# EAGLE design CERVEAU_01b (EAGLE 8.5.1)
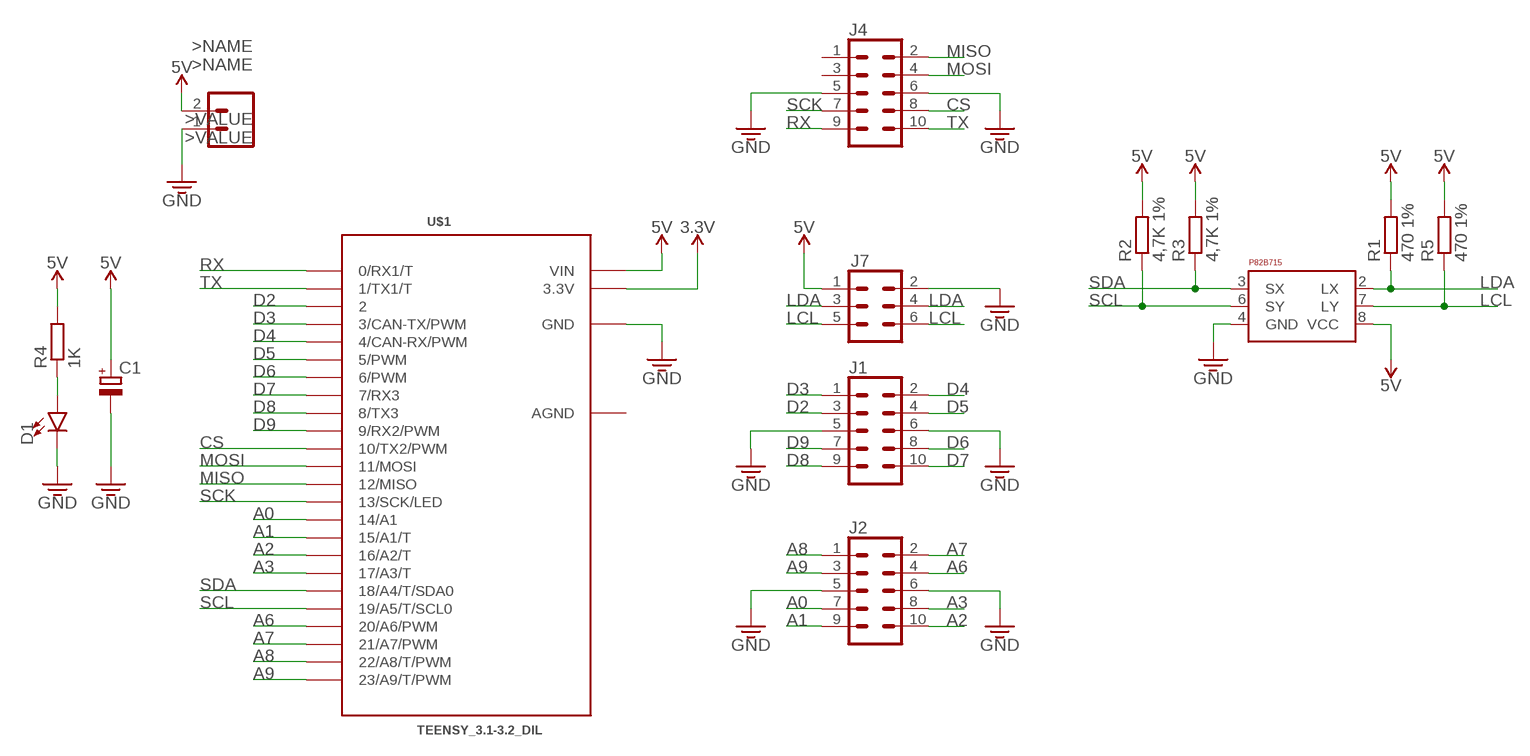
[diagram p0: schematic, sheet 1]

## Parts
C1  CPOL-EUE2.5-6  [E2,5-6]
D1  LED5MM  [LED_5MM]
J1  CONN_05X2SHD  [2X5-SHROUDED]
J2  CONN_05X2SHD  [2X5-SHROUDED]
J3  CONN_02POLAR  [MOLEX-1X2]
J4  CONN_05X2SHD  [2X5-SHROUDED]
J7  CONN_03X2SHROUD  [2X3-SHROUDED]
R1  470 1%  R-EU_0207/2V  [0207/2V]
R2  4,7K 1%  R-EU_0207/2V  [0207/2V]
R3  4,7K 1%  R-EU_0207/2V  [0207/2V]
R4  1K  R-EU_0207/2V  [0207/2V]
R5  470 1%  R-EU_0207/2V  [0207/2V]
U$1  TEENSY_3.1-3.2_DIL  [TEENSY_3.0-3.2&LC_DIL]
U$2  P82B715  [SOCKET-08]

## Nets
3.3V: U$1.3.3V
5V: C1.+ J3.2 J7.1 R1.2 R2.2 R3.2 R4.2 R5.2 U$1.VIN U$2.8(VCC)
A0: J2.7 U$1.14/A0(14/A1)
A1: J2.9 U$1.15/A1(15/A1/T)
A2: J2.10 U$1.16/A2(16/A2/T)
A3: J2.8 U$1.17/A3(17/A3/T)
A6: J2.4 U$1.20/A6(20/A6/PWM)
A7: J2.2 U$1.21/A7(21/A7/PWM)
A8: J2.1 U$1.22/A8(22/A8/T/PWM)
A9: J2.3 U$1.23/A9(23/A9/T/PWM)
CS: J4.8 U$1.10(10/TX2/PWM)
D2: J1.3 U$1.2
D3: J1.1 U$1.3(3/CAN-TX/PWM)
D4: J1.2 U$1.4(4/CAN-RX/PWM)
D5: J1.4 U$1.5(5/PWM)
D6: J1.8 U$1.6(6/PWM)
D7: J1.10 U$1.7(7/RX3)
D8: J1.9 U$1.8(8/TX3)
D9: J1.7 U$1.9(9/RX2/PWM)
GND: C1.- D1.K(C) J1.5 J1.6 J2.5 J2.6 J3.1 J4.5 J4.6 J7.2 U$1.GND U$2.4(GND)
LCL: J7.5 J7.6 R5.1 U$2.7(LY)
LDA: J7.3 J7.4 R1.1 U$2.2(LX)
MISO: J4.2 U$1.12(12/MISO)
MOSI: J4.4 U$1.11(11/MOSI)
N$1: D1.A R4.1
RX: J4.9 U$1.0(0/RX1/T)
SCK: J4.7 U$1.13(13/SCK/LED)
SCL: R2.1 U$1.19/A5(19/A5/T/SCL0) U$2.6(SY)
SDA: R3.1 U$1.18/A4(18/A4/T/SDA0) U$2.3(SX)
TX: J4.10 U$1.1(1/TX1/T)
Unconnected: J4.1 J4.3

## Power pins joined to a net without a drawn wire
AGND: U$1.AGND

## Library data of the parts
C1 = rcl:CPOL-EU: POLARIZED CAPACITOR, European symbol
D1 = OPENBOT:LED: LED (Generic) Standard schematic elements and footprints for 5mm, 3mm, 1206, and 0603 sized LEDs. Generic LEDs with no color specified.
J1 J2 J4 = OPENBOT:CONN_05X2: Multi connection point. Often used as Generic Header-pin footprint for 0.1 inch spaced/style header connections For AVR SPI programming port, see special device with nice symbol: "AVR_SPI_PROG_5x2.dev" You can populate with any combo of single row headers, but if you'd like an exact match, check these: 2x5 AVR ICSP Male Header <https://www.sparkfun.com/products/778> (PRT-00778) 2x5 Pin Shrouded Header <https://www.sparkfun.com/products/8506> (PRT-08506) On any of the 0.1 inch spaced packages, you can populate with these: Break Away Headers - Straight <https://www.sparkfun.com/products/116> (PRT-00116) Break Away Male Headers - Right Angle <https://www.sparkfun.com/products/553> (PRT-00553) Female Headers <https://www.sparkfun.com/products/115> (PRT-00115) Break Away Headers - Machine Pin <https://www.sparkfun.com/products/117> (PRT-00117) Break Away Female Headers - Swiss Machine Pin <https://www.sparkfun.com/products/743> (PRT-00743) Special note: the shrouded connector mates well with our 5x2 ribbon cables: 2x5 Pin IDC Ribbon Cable <https://www.sparkfun.com/products/8535> (PRT-08535); PROD_ID: CONN-08671; SF_ID: PRT-08506
J3 = OPENBOT:CONN_02: Multi connection point. Often used as Generic Header-pin footprint for 0.1 inch spaced/style header connections On any of the 0.1 inch spaced packages, you can populate with these: Break Away Headers - Straight <https://www.sparkfun.com/products/116> (PRT-00116) Break Away Male Headers - Right Angle <https://www.sparkfun.com/products/553> (PRT-00553) Female Headers <https://www.sparkfun.com/products/115> (PRT-00115) Break Away Headers - Machine Pin <https://www.sparkfun.com/products/117> (PRT-00117) Break Away Female Headers - Swiss Machine Pin <https://www.sparkfun.com/products/743> (PRT-00743) For SCREWTERMINALS and SPRING TERMINALS visit here: Screw Terimnals on SparkFun.com <https://www.sparkfun.com/search/results?term=Screw+Terminals> (5mm/3.5mm/2.54mm spacing) This device is also useful as a general connection point to wire up your design to another part of your project. Our various solder wires solder well into these plated through hole pads. Hook-Up Wire - Assortment (Stranded, 22 AWG) <https://www.sparkfun.com/products/11375> (PRT-11375) Hook-Up Wire - Assortment (Solid Core, 22 AWG) <https://www.sparkfun.com/products/11367> (PRT-11367) View the entire wire category on our website here <https://www.sparkfun.com/categories/141> Special notes: Molex polarized connector foot print use with: PRT-08233 with associated crimp pins and housings. 2.54_SCREWTERM for use with PRT-10571. 3.5mm Screw Terminal footprints for PRT-08084 5mm Screw Terminal footprints for use with PRT-08432 Multi connection point. Often used as Generic Header-pin footprint for 0.1 inch spaced/style header connections On any of the 0.1 inch spaced packages, you can populate with these: Break Away Headers - Straight <https://www.sparkfun.com/products/116> (PRT-00116) Break Away Male Headers - Right Angle <https://www.sparkfun.com/products/553> (PRT-00553) Female Headers <https://www.sparkfun.com/products/115> (PRT-00115) Break Away Headers - Machine Pin <https://www.sparkfun.com/products/117> (PRT-00117) Break Away Female Headers - Swiss Machine Pin <https://www.sparkfun.com/products/743> (PRT-00743) For SCREWTERMINALS and SPRING TERMINALS visit here: Screw Terimnals on SparkFun.com <https://www.sparkfun.com/search/results?term=Screw+Terminals> (5mm/3.5mm/2.54mm spacing) This device is also useful as a general connection point to wire up your design to another part of your project. Our various solder wires solder well into these plated through hole pads. Hook-Up Wire - Assortment (Stranded, 22 AWG) <https://www.sparkfun.com/products/11375> (PRT-11375) Hook-Up Wire - Assortment (Solid Core, 22 AWG) <https://www.sparkfun.com/products/11367> (PRT-11367) View the entire wire category on our website here <https://www.sparkfun.com/categories/141> Special notes: Molex polarized connector foot print use with: PRT-08233 with associated crimp pins and housings. 2.54_SCREWTERM for use with PRT-10571. 3.5mm Screw Terminal footprints for PRT-08084 5mm Screw Terminal footprints for use with PRT-08432; SF_ID: PRT-09918
J7 = OPENBOT:CONN_03X2: Multi connection point. Often used as Generic Header-pin footprint for 0.1 inch spaced/style header connections You can populate with any combo of single row headers, but if you'd like an exact match, check these: Header - 2x3 (Male, 0.1") <https://www.sparkfun.com/products/12807> (PRT-12807) Header - 2x3 (Female, 0.1") <https://www.sparkfun.com/products/13010> (PRT-13010) 2x3 Pin Shrouded Header <https://www.sparkfun.com/products/10877> (PRT-10877) On any of the 0.1 inch spaced packages, you can populate with these: Break Away Headers - Straight <https://www.sparkfun.com/products/116> (PRT-00116) Break Away Male Headers - Right Angle <https://www.sparkfun.com/products/553> (PRT-00553) Female Headers <https://www.sparkfun.com/products/115> (PRT-00115) Break Away Headers - Machine Pin <https://www.sparkfun.com/products/117> (PRT-00117) Break Away Female Headers - Swiss Machine Pin <https://www.sparkfun.com/products/743> (PRT-00743) Special note: the shrouded connector mates well with our 3x2 ribbon cables: Ribbon Crimp Connector - 6-pin (2x3, Female) <https://www.sparkfun.com/products/10651> (PRT-10651) Ribbon Cable - 6 wire (15ft) <https://www.sparkfun.com/products/10646> (PRT-10646); PROD_ID: CONN-10681; SF_ID: PRT_10877
R1-R5 = rcl:R-EU_: RESISTOR, European symbol
U$1 = Teensy_3_and_LC_Series_Boards_v1.4:TEENSY_3.1-3.2_DIL: Teensy 3.1 or 3.2 in a DIL Layout.
U$2 = KARIBOUS:P82B715

## Board
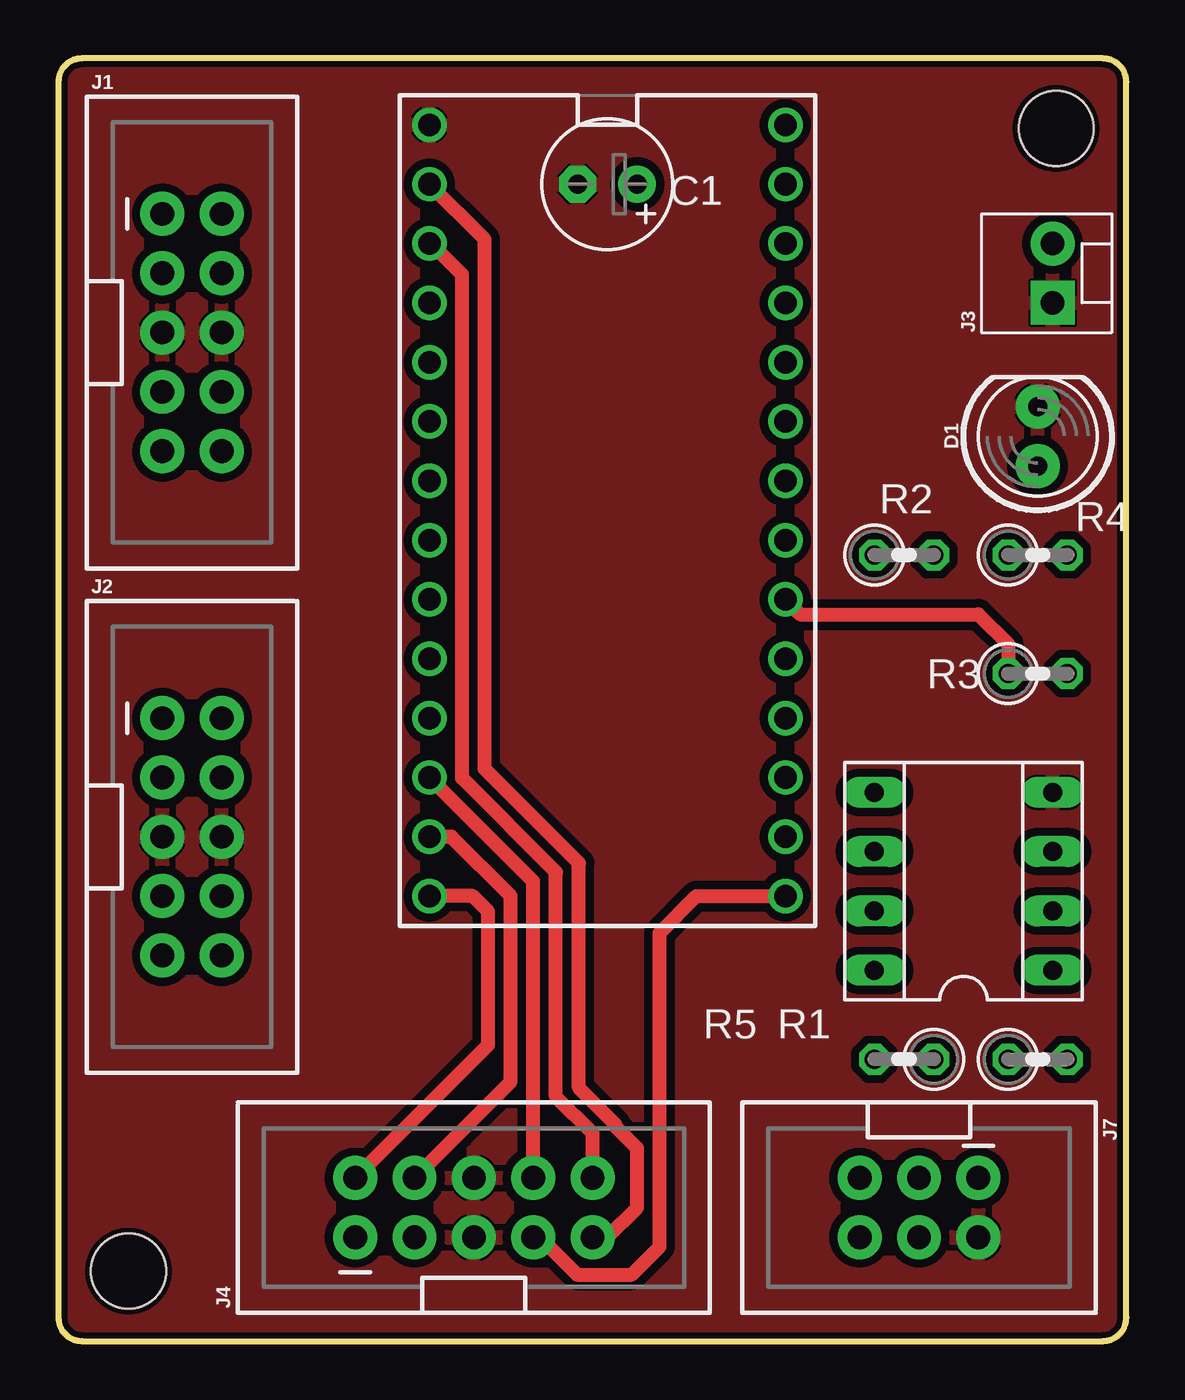
[diagram p1: board, top side]
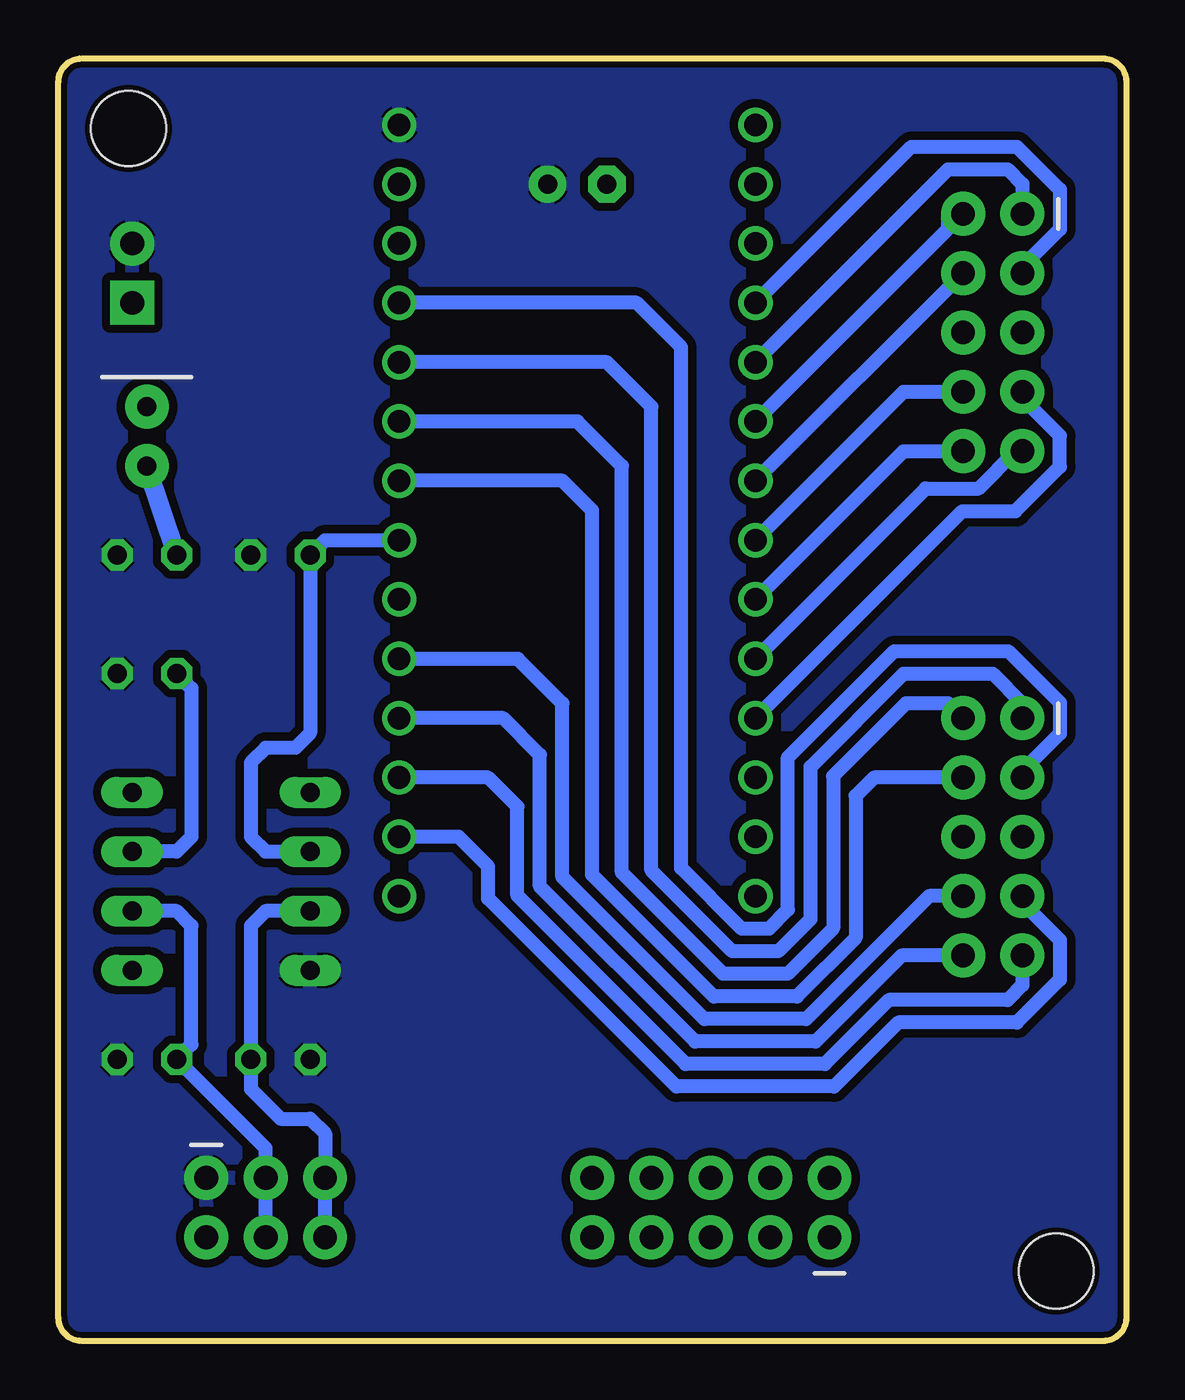
[diagram p2: board, bottom side, seen from below]

Size 45.7 x 54.91 mm. Coordinates in mm from the lower left corner, seen from the top.
Outline: 44.7,0 arc90 45.7,1 45.7,53.91 arc90 44.7,54.91 1,54.91 arc90 0,53.91 0,1 arc90 1,0 44.7,0
Copper layers (1*16): Top 0.035mm / dielectric 1.5mm / Bottom 0.035mm
Design rules "SeeedStudio_2layer_DRU_no_angle_20140221 *": minimum track width 6mil, minimum drill 12mil, track to track 14mil, track to pad 14mil, pad to pad 14mil, via to via 14mil, smd to smd 0mil, copper to edge 10mil, drill to drill 10mil, minimum pad ring 10mil, minimum via ring 6mil, stop-mask expansion 2mil, vias tented up to drill 100mil, thermal gap 4mil
Holes 3.2 mm at 3,3 42.7,51.91

### Footprints (pad centres in the part's own frame; a part is rotated, then mirrored left to right if it is on the bottom)
E2,5-6 = drill 0.813 pad 1.6: + -1.27,0 | drill 0.813 pad 1.6 octagon: - 1.27,0
LED_5MM = drill 0.813 pad 1.88: A -1.27,0; K 1.27,0
2X5-SHROUDED = drill 1.016 pad 1.88: 1 -1.27,5.08; 2 1.27,5.08; 3 -1.27,2.54; 4 1.27,2.54; 5 -1.27,0; 6 1.27,0; 7 -1.27,-2.54; 8 1.27,-2.54; 9 -1.27,-5.08; 10 1.27,-5.08
MOLEX-1X2 = drill 1.016 pad 1.88 square: 1 0,0 | drill 1.016 pad 1.88: 2 2.54,0
2X3-SHROUDED = drill 1.016 pad 1.88: 1 -1.27,2.54; 2 1.27,2.54; 3 -1.27,0; 4 1.27,0; 5 -1.27,-2.54; 6 1.27,-2.54
0207/2V = drill 0.813 octagon: 1 -1.27,0; 2 1.27,0
TEENSY_3.0-3.2&LC_DIL = drill 0.965: 0 -7.62,13.97; 1 -7.62,11.43; 2 -7.62,8.89; 3 -7.62,6.35; 3.3V 7.62,11.43; 4 -7.62,3.81; 5 -7.62,1.27; 6 -7.62,-1.27; 7 -7.62,-3.81; 8 -7.62,-6.35; 9 -7.62,-8.89; 10 -7.62,-11.43; 11 -7.62,-13.97; 12 -7.62,-16.51; 13 7.62,-16.51; 14/A0 7.62,-13.97; 15/A1 7.62,-11.43; 16/A2 7.62,-8.89; 17/A3 7.62,-6.35; 18/A4 7.62,-3.81; 19/A5 7.62,-1.27; 20/A6 7.62,1.27; 21/A7 7.62,3.81; 22/A8 7.62,6.35; 23/A9 7.62,8.89; AGND 7.62,13.97; GND -7.62,16.51; VIN 7.62,16.51
SOCKET-08 = drill 0.813 long: 1 -3.81,-3.81; 2 -1.27,-3.81; 3 1.27,-3.81; 4 3.81,-3.81; 5 3.81,3.81; 6 1.27,3.81; 7 -1.27,3.81; 8 -3.81,3.81

### Placement (x,y rotation side)
C1  23.5,49.53 180 top
D1  41.91,38.73 90 top
J1  5.71,43.18 0 top
J2  5.71,21.59 0 top
J3  42.55,44.45 90 top
J4  17.78,5.71 90 top
J7  36.83,5.71 270 top
R1  41.91,12.06 0 top
R2  36.2,33.66 0 top
R3  41.91,28.57 0 top
R4  41.91,33.66 0 top
R5  36.2,12.06 180 top
U$1  23.5,35.56 0 top
U$2  38.73,19.68 90 top

### Tracks (layer width: path | path; a pad name or v marks a point on that pad's centre or on a via)
5V
  pour Bottom: -1.27,60.33 48.9,60.33 48.9,-1.27 -1.27,-1.27
A0
  Bottom 0.61: J2.7 4.45,18.77 2.85,17.17 2.85,15.47 4.68,13.64 9.76,13.64 12.5,10.9 19.25,10.9 27.3,18.95 27.3,20.32 28.57,21.59 U$1.14/A0
A1
  Bottom 0.61: J2.9 4.45,15.24 5.08,14.61 10.15,14.61 12.9,11.86 18.85,11.86 26.06,19.07 26.06,22.89 27.3,24.13 U$1.15/A1
A2
  Bottom 0.61: J2.10 9.61,16.51 13.3,12.83 18.45,12.83 25.09,19.47 25.09,25.09 26.67,26.67 U$1.16/A2
A3
  Bottom 0.61: J2.8 8.44,19.05 13.7,13.79 18.05,13.79 24.13,19.87 24.13,27.3 26.04,29.21 U$1.17/A3
A6
  Bottom 0.61: J2.4 10.79,24.13 11.58,23.34 11.58,17.27 14.1,14.76 17.65,14.76 22.86,19.96 22.86,35.56 24.13,36.83 U$1.20/A6
A7
  Bottom 0.61: J2.2 7.62,27.3 9.43,27.3 12.55,24.19 12.55,17.67 14.5,15.72 17.25,15.72 21.59,20.06 21.59,37.47 23.5,39.37 U$1.21/A7
A8
  Bottom 0.61: U$1.22/A8 22.23,41.91 20.32,40.01 20.32,20.15 16.85,16.69 14.9,16.69 13.51,18.07 13.51,24.59 9.53,28.57 5.71,28.57 4.45,27.3 J2.1
A9
  Bottom 0.61: U$1.23/A9 20.95,44.45 19.05,42.55 19.05,20.25 16.45,17.65 15.3,17.65 14.48,18.47 14.48,24.99 9.93,29.54 5.05,29.54 2.85,27.33 2.85,26.01 4.45,24.41 J2.3
CS
  Top 0.61: J4.8 20.32,19.68 U$1.10
D2
  Bottom 0.61: U$1.2 9.2,51.13 4.68,51.13 2.85,49.3 2.85,47.6 4.45,46 J1.3
D3
  Bottom 0.61: U$1.3 7.62,50.16 5.08,50.16 4.45,49.53 J1.1
D4
  Bottom 0.61: U$1.4 7.62,47.62 7.62,48.26 J1.2
D5
  Bottom 0.61: U$1.5 J1.4
D6
  Bottom 0.61: U$1.6 9.53,40.64 J1.8
D7
  Bottom 0.61: U$1.7 9.53,38.1 J1.10
D8
  Bottom 0.61: U$1.8 8.59,36.5 6.32,36.5 4.72,38.1 J1.9
D9
  Bottom 0.61: U$1.9 7.01,35.53 4.75,35.53 2.85,37.44 2.85,38.76 4.45,40.36 J1.7
GND
  pour Top: -1.27,59.05 48.9,59.05 48.9,-1.27 -1.27,-1.27
LCL
  Bottom 0.61: U$2.7 36.83,18.41 37.47,17.78 R5.1 37.47,10.79 36.2,9.53 34.92,9.53 34.29,8.89 J7.5 J7.6
LDA
  Bottom 0.61: U$2.2 40.64,18.41 40.01,17.78 40.01,12.7 R1.1 36.83,8.26 J7.3 J7.4
MISO
  Top 0.61: J4.2 18.39,12.68 18.39,18.39 17.73,19.05 U$1.12
MOSI
  Top 0.61: J4.4 19.36,11.1 19.36,19.05 16.82,21.59 U$1.11
N$1
  Bottom 0.813: R4.1 D1.A
RX
  Top 0.61: J4.9 23.5,4.45 24.77,5.71 24.77,8.26 23.82,9.2 23.82,9.29 22.27,10.84 22.27,20.46 18.24,24.5 18.24,47.17 U$1.0
SCK
  Top 0.61: J4.7 20.6,4.45 22.2,2.85 24.53,2.85 25.73,4.04 25.73,17.48 27.3,19.05 U$1.13
SCL
  Bottom 0.61: U$1.19/A5 34.29,34.29 R2.1 34.92,26.04 35.56,25.4 36.83,25.4 37.47,24.77 37.47,21.59 36.83,20.95 U$2.6
SDA
  Top 0.61: U$1.18/A4 31.75,31.11 39.37,31.11 40.64,29.84 R3.1
  Bottom 0.61: R3.1 40.01,27.94 40.01,21.59 40.64,20.95 U$2.3
TX
  Top 0.61: J4.10 22.86,8.89 21.29,10.46 21.29,20.09 17.27,24.1 17.27,45.66 15.88,47.06 U$1.1